# Altium schematic sheet Sheet1.SchDoc
size A
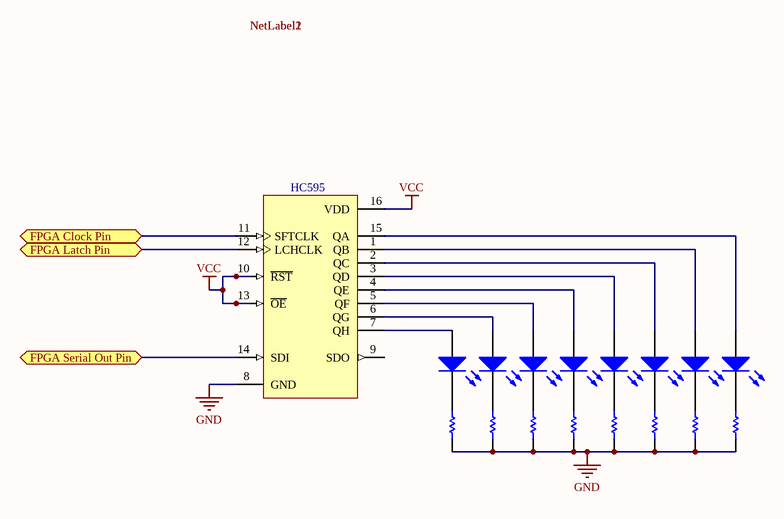
[diagram p0: Sheet1.SchDoc]

## Parts
(Parts that share a designator on the sheet are numbered #1, #2 ... from top to bottom, then left to right.)
D?#1  LED1  [LED-1]  (value not drawn)
D?#2  LED1  [LED-1]  (value not drawn)
D?#3  LED1  [LED-1]  (value not drawn)
D?#4  LED1  [LED-1]  (value not drawn)
D?#5  LED1  [LED-1]  (value not drawn)
D?#6  LED1  [LED-1]  (value not drawn)
D?#7  LED1  [LED-1]  (value not drawn)
D?#8  LED1  [LED-1]  (value not drawn)
R?#1  Res1  [AXIAL-0.3]  (value not drawn)
R?#2  Res1  [AXIAL-0.3]  (value not drawn)
R?#3  Res1  [AXIAL-0.3]  (value not drawn)
R?#4  Res1  [AXIAL-0.3]  (value not drawn)
R?#5  Res1  [AXIAL-0.3]  (value not drawn)
R?#6  Res1  [AXIAL-0.3]  (value not drawn)
R?#7  Res1  [AXIAL-0.3]  (value not drawn)
R?#8  Res1  [AXIAL-0.3]  (value not drawn)
U?  HC595  [620-09]

## Ports
FPGA Clock Pin, FPGA Latch Pin, FPGA Serial Out Pin

## Nets
GND: R?#1.1 R?#2.1 R?#3.1 R?#4.1 R?#5.1 R?#6.1 R?#7.1 R?#8.1 U?.8(GND)
VCC: U?.10(~{RST}) U?.13(~{OE}) U?.16(VDD)
FPGA Clock Pin: U?.11(SFTCLK) ; port FPGA Clock Pin
FPGA Latch Pin: U?.12(LCHCLK) ; port FPGA Latch Pin
FPGA Serial Out Pin: U?.14(SDI) ; port FPGA Serial Out Pin
NetD?#1_1: D?#1.1(A) U?.7(QH)
NetD?#1_2: D?#1.2(K) R?#1.2
NetD?#2_1: D?#2.1(A) U?.6(QG)
NetD?#2_2: D?#2.2(K) R?#2.2
NetD?#3_1: D?#3.1(A) U?.5(QF)
NetD?#3_2: D?#3.2(K) R?#3.2
NetD?#4_1: D?#4.1(A) U?.4(QE)
NetD?#4_2: D?#4.2(K) R?#4.2
NetD?#5_1: D?#5.1(A) U?.3(QD)
NetD?#5_2: D?#5.2(K) R?#5.2
NetD?#6_1: D?#6.1(A) U?.2(QC)
NetD?#6_2: D?#6.2(K) R?#6.2
NetD?#7_1: D?#7.1(A) U?.1(QB)
NetD?#7_2: D?#7.2(K) R?#7.2
NetD?#8_1: D?#8.1(A) U?.15(QA)
NetD?#8_2: D?#8.2(K) R?#8.2

Not connected (* = marked no-connect by the designer): U? 9(SDO)

## Library data of the parts
D?#1-D?#8 = LED1: Typical RED GaAs LED; Published: 8-Jun-2000; LatestRevisionDate: 08-Jul-2005; LatestRevisionNote: Mech Layer 1 removed.; PackageReference: LED-1; Publisher: Altium Limited; PackageDescription: LED; 2 Leads
R?#1-R?#8 = Res1: Resistor; Value: 1K; Published: 8-Jun-2000; LatestRevisionDate: 17-Jul-2002; LatestRevisionNote: Re-released for DXP Platform.; PackageReference: AXIAL-0.3; Publisher: Altium Limited; PackageDescription: Axial Device, Thru-Hole; 2 Leads; 0.3 in Pin Spacing
U? = MC54HC595AJ: 8-Bit Serial-Input/Serial-or-Parallel-Output Shift Register with Latched 3-State Outputs; Published: 17-Jul-2002; LatestRevisionDate: 06-Jun-2005; LatestRevisionNote: Stylized 3D Model Added; DatasheetVersion: 1989; PackageReference: 620-09; Publisher: Altium Limited; PackageDescription: DIP; 16 Leads; Row Spacing 7.62 mm; Pitch 2.54 mm; Code_JEDEC: MS-001-BB; ComponentLink1Description: Manufacturer Link; ComponentLink1URL: http://www.onsemi.com/site/products/parametrics/0,4446,557,00.html